# EAGLE design power (EAGLE 9.6.2)
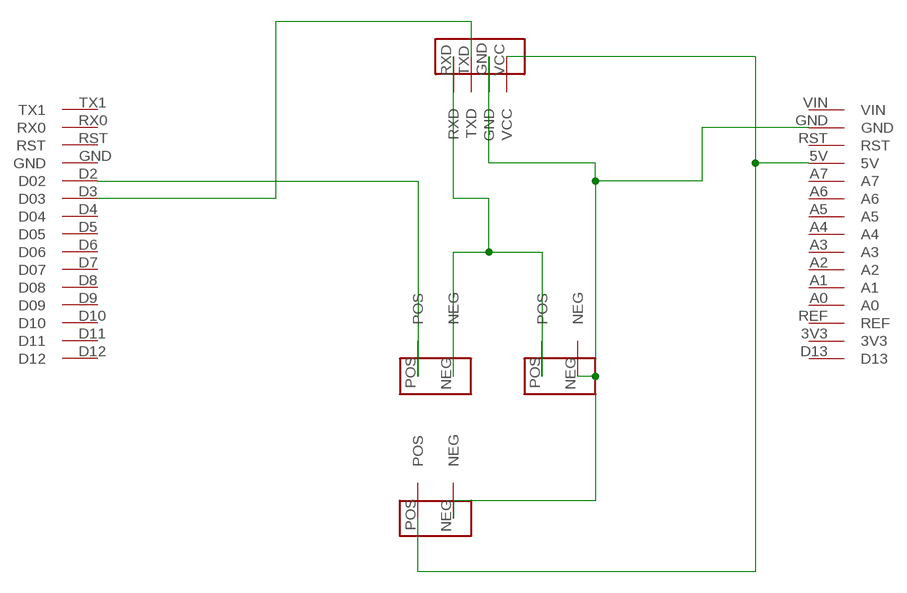
[diagram p0: schematic, sheet 1]

## Parts
POWER  CAP  [CAP]
U$1  ARDUINO-NANO-JUMPER-1  [ARDUINO-NANO-JUMPER-1]
U$2  ARDUINO-NANO-JUMPER-2  [ARDUINO-NANO-JUMPER-2]
U$3  RESISTOR  [RESISTOR]
U$4  RESISTOR  [RESISTOR]
U$6  BT  [BT]

## Nets
5V: POWER.POS U$2.5V U$6.VCC
D02: U$1.D2(D02) U$3.POS
D03: U$1.D3(D03) U$6.TXD
GND: POWER.NEG U$2.GND U$4.NEG U$6.GND
RX: U$3.NEG U$4.POS U$6.RXD
Unconnected: U$1.D4(D04) U$1.D5(D05) U$1.D6(D06) U$1.D7(D07) U$1.D8(D08) U$1.D9(D09) U$1.D10 U$1.D11 U$1.D12 U$1.GND U$1.RST U$1.RX0 U$1.TX1 U$2.3V3 U$2.A0 U$2.A1 U$2.A2 U$2.A3 U$2.A4 U$2.A5 U$2.A6 U$2.A7 U$2.D13 U$2.REF U$2.RST U$2.VIN

## Library data of the parts
POWER = RC Car:CAP
U$1 = RC Car:ARDUINO-NANO-JUMPER-1
U$2 = RC Car:ARDUINO-NANO-JUMPER-2
U$3 U$4 = RC Car:RESISTOR
U$6 = RC Car:BT

## Board
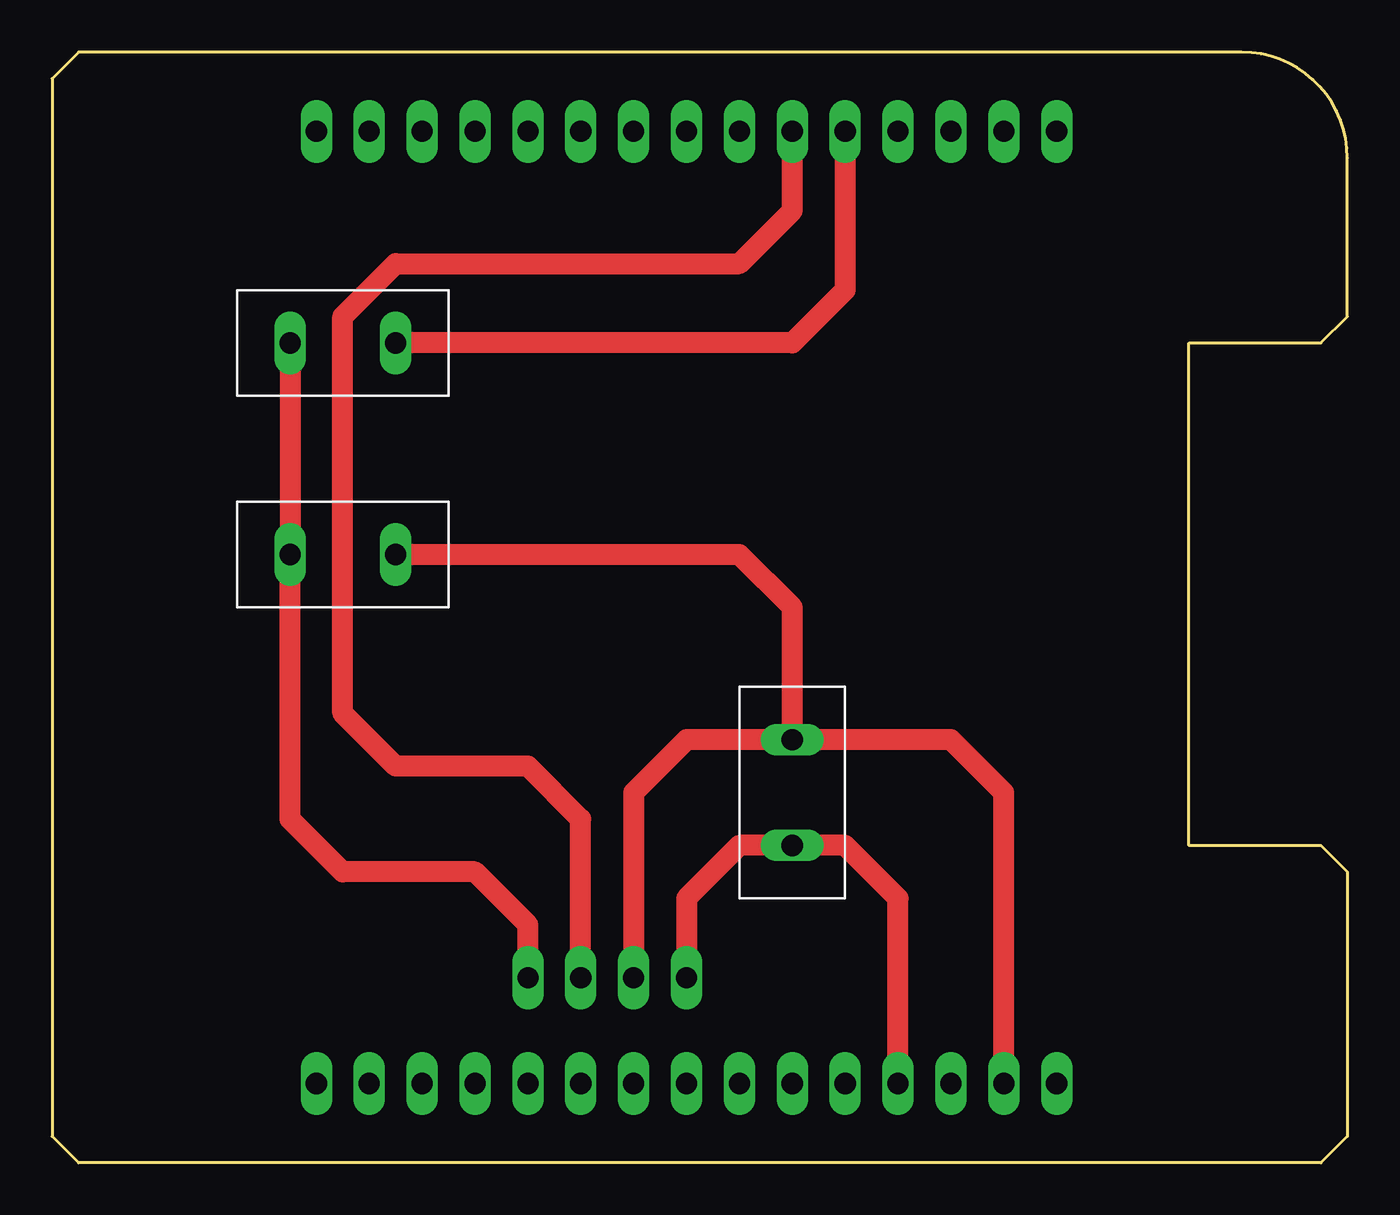
[diagram p1: board, top side]

Size 62.23 x 53.34 mm. Coordinates in mm from the lower left corner, seen from the top.
Outline: 54.61,39.37 60.96,39.37 62.23,40.64 62.23,48.26 arc90 57.15,53.34 1.27,53.34 0,52.07 0,1.27 1.27,0 60.96,0 62.23,1.27 62.23,13.97 60.96,15.24 54.61,15.24 54.61,39.37
Copper layers (1*16): Top 0.035mm / dielectric 1.5mm / Bottom 0.035mm
Design rules "default": minimum track width 6mil, minimum drill 0.35mm, track to track 6mil, track to pad 6mil, pad to pad 6mil, via to via 6mil, smd to smd 6mil, copper to edge 40mil, drill to drill 6mil, minimum pad ring 10mil, minimum via ring 8mil, stop-mask expansion 4mil, vias tented up to drill 0mil, thermal gap 10mil

### Footprints (pad centres in the part's own frame; a part is rotated, then mirrored left to right if it is on the bottom)
CAP = drill 1.016 long: NEG 2.54,0; POS -2.54,0
ARDUINO-NANO-JUMPER-1 = drill 1.016 long: D2 7.62,0; D3 5.08,0; D4 2.54,0; D5 0,0; D6 -2.54,0; D7 -5.08,0; D8 -7.62,0; D9 -10.16,0; D10 -12.7,0; D11 -15.24,0; D12 -17.78,0; GND 10.16,0; RST 12.7,0; RX0 15.24,0; TX1 17.78,0
ARDUINO-NANO-JUMPER-2 = drill 1.016 long: 3V3 -15.24,0; 5V 10.16,0; A0 -10.16,0; A1 -7.62,0; A2 -5.08,0; A3 -2.54,0; A4 0,0; A5 2.54,0; A6 5.08,0; A7 7.62,0; D13 -17.78,0; GND 15.24,0; REF -12.7,0; RST 12.7,0; VIN 17.78,0
RESISTOR = drill 1.016 long: NEG 2.54,0; POS -2.54,0
BT = drill 1.016 long: GND 2.54,0; RXD 7.62,0; TXD 5.08,0; VCC 0,0

### Placement (x,y rotation side)
POWER  35.56,17.78 90 top
U$1  30.48,49.53 0 top
U$2  30.48,3.81 0 top
U$3  13.97,39.37 180 top
U$4  13.97,29.21 0 top
U$6  30.48,8.89 180 top

### Tracks (layer width: path | path; a pad name or v marks a point on that pad's centre or on a via)
5V
  Top 1.016: U$6.VCC 30.48,12.7 33.02,15.24 POWER.POS 38.1,15.24 40.64,12.7 U$2.5V
D02
  Top 1.016: U$1.D2 38.1,41.91 35.56,39.37 U$3.POS
D03
  Top 1.016: U$1.D3 35.56,45.72 33.02,43.18 16.51,43.18 13.97,40.64 13.97,21.59 16.51,19.05 22.86,19.05 25.4,16.51 U$6.TXD
GND
  Top 1.016: POWER.NEG 35.56,26.67 33.02,29.21 U$4.NEG | POWER.NEG 30.48,20.32 27.94,17.78 U$6.GND | U$2.GND 45.72,17.78 43.18,20.32 POWER.NEG
RX
  Top 1.016: U$3.NEG U$4.POS 11.43,16.51 13.97,13.97 20.32,13.97 22.86,11.43 U$6.RXD